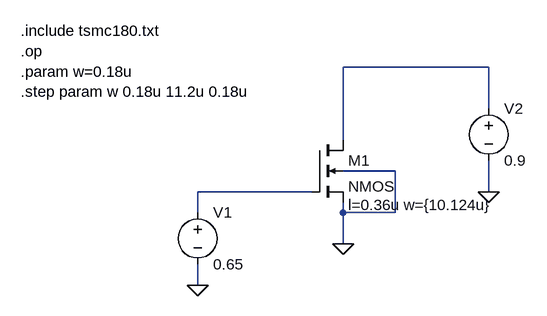
[diagram p0: schematic Common source amplifier with diode connected.asc]
Common source amplifier with diode connected.asc, the LTspice schematic file:
Version 4
SHEET 1 880 680
WIRE 400 16 176 16
WIRE 400 80 400 16
WIRE 176 128 176 16
WIRE 256 176 176 176
WIRE 128 208 -48 208
WIRE 400 208 400 160
WIRE -48 240 -48 208
WIRE 176 240 176 224
WIRE 256 240 256 176
WIRE 256 240 176 240
WIRE 176 288 176 240
WIRE -48 352 -48 320
FLAG 176 288 0
FLAG 400 208 0
FLAG -48 352 0
SYMBOL nmos4 128 128 R0
WINDOW 123 56 100 Left 2
SYMATTR InstName M1
SYMATTR Value2 l=0.36u w={10.124u}
SYMBOL voltage -48 224 R0
WINDOW 123 0 0 Left 0
WINDOW 39 0 0 Left 0
SYMATTR InstName V1
SYMATTR Value 0.65
SYMBOL voltage 400 64 R0
WINDOW 123 0 0 Left 0
WINDOW 39 0 0 Left 0
SYMATTR InstName V2
SYMATTR Value 0.9
TEXT -320 -40 Left 2 !.include tsmc180.txt\n.op\n.param w=0.18u\n.step param w 0.18u 11.2u 0.18u

The netlist it stands for:
* Common source amplifier with diode connected.asc
M1 N001 N002 0 0 NMOS l=0.36u w={10.124u}
V1 N002 0 0.65
V2 N001 0 0.9
.model NMOS NMOS
.model PMOS PMOS
.lib standard.mos
.include tsmc180.txt
.op
.param w=0.18u
.step param w 0.18u 11.2u 0.18u
.backanno
.end